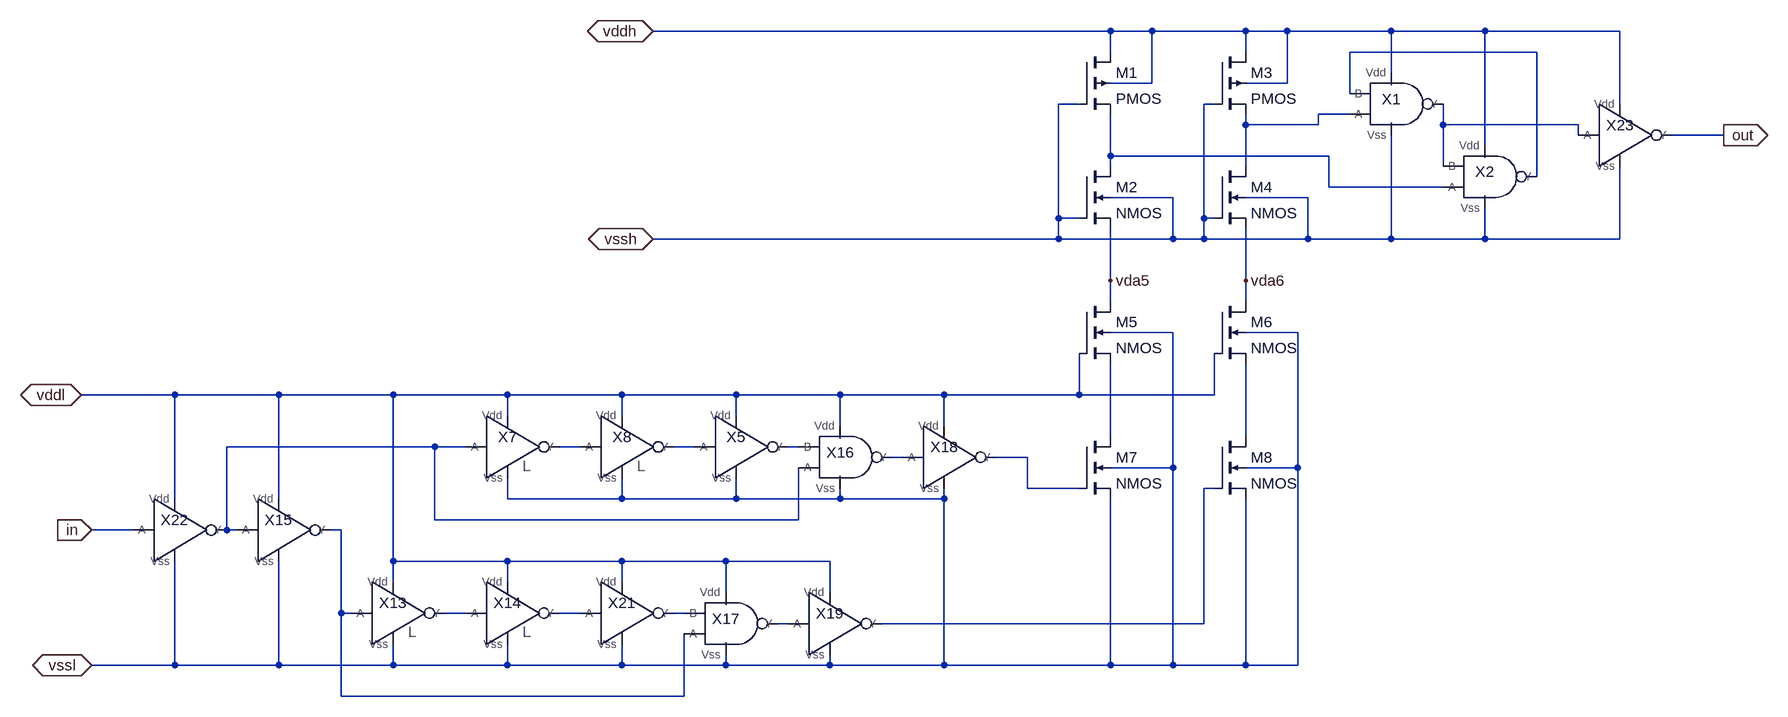
[diagram p0: schematic pulsels.asc]
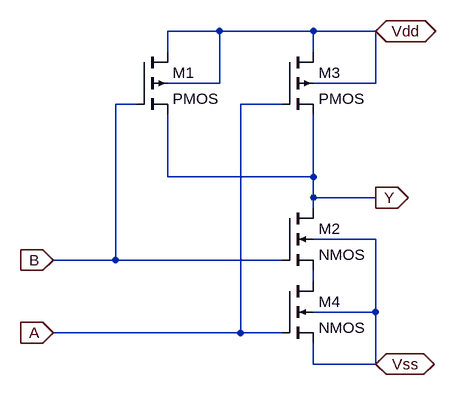
[diagram p1: sub-circuit nand1.asc]
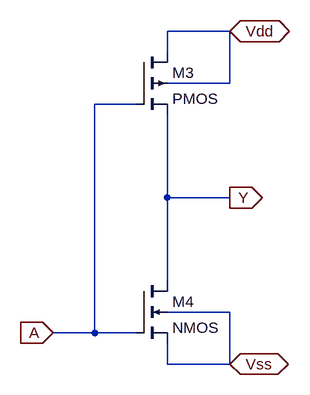
[diagram p2: sub-circuit inv1l.asc]
pulsels.asc, the LTspice schematic file:
Version 4
SHEET 1 1080 1048
WIRE 32 0 -672 0
WIRE 96 0 32 0
WIRE 240 0 96 0
WIRE 304 0 240 0
WIRE 464 0 304 0
WIRE 608 0 464 0
WIRE 816 0 608 0
WIRE 32 32 32 0
WIRE 240 32 240 0
WIRE 688 32 400 32
WIRE 464 64 464 0
WIRE 96 80 96 0
WIRE 96 80 32 80
WIRE 304 80 304 0
WIRE 304 80 240 80
WIRE 400 96 400 32
WIRE -16 112 -48 112
WIRE 192 112 176 112
WIRE 816 112 816 0
WIRE 400 128 352 128
WIRE 240 144 240 128
WIRE 352 144 352 128
WIRE 352 144 240 144
WIRE 544 144 544 112
WIRE 752 144 544 144
WIRE 752 160 752 144
WIRE 976 160 896 160
WIRE 608 176 608 0
WIRE 32 192 32 128
WIRE 368 192 32 192
WIRE 32 208 32 192
WIRE 240 208 240 144
WIRE 544 208 544 144
WIRE 688 224 688 32
WIRE 368 240 368 192
WIRE 544 240 368 240
WIRE 128 256 32 256
WIRE 336 256 240 256
WIRE -48 288 -48 112
WIRE -16 288 -48 288
WIRE 176 288 176 112
WIRE 192 288 176 288
WIRE -48 320 -48 288
WIRE -48 320 -672 320
WIRE 128 320 128 256
WIRE 128 320 -48 320
WIRE 176 320 176 288
WIRE 176 320 128 320
WIRE 336 320 336 256
WIRE 336 320 176 320
WIRE 464 320 464 160
WIRE 464 320 336 320
WIRE 608 320 608 272
WIRE 608 320 464 320
WIRE 816 320 816 208
WIRE 816 320 608 320
WIRE 32 384 32 304
WIRE 240 384 240 304
WIRE 32 416 32 384
WIRE 240 416 240 384
WIRE 128 464 32 464
WIRE 320 464 240 464
WIRE -1408 560 -1552 560
WIRE -1248 560 -1408 560
WIRE -1072 560 -1248 560
WIRE -896 560 -1072 560
WIRE -720 560 -896 560
WIRE -544 560 -720 560
WIRE -384 560 -544 560
WIRE -224 560 -384 560
WIRE -16 560 -16 496
WIRE -16 560 -224 560
WIRE 192 560 192 496
WIRE 192 560 -16 560
WIRE -896 592 -896 560
WIRE -720 592 -720 560
WIRE -544 592 -544 560
WIRE -384 608 -384 560
WIRE -224 608 -224 560
WIRE 32 624 32 512
WIRE 240 624 240 512
WIRE -1008 640 -1328 640
WIRE -960 640 -1008 640
WIRE -784 640 -816 640
WIRE -608 640 -640 640
WIRE -448 640 -464 640
WIRE -288 656 -304 656
WIRE -96 656 -144 656
WIRE 128 672 128 464
WIRE 128 672 32 672
WIRE 320 672 320 464
WIRE 320 672 240 672
WIRE -96 704 -96 656
WIRE -16 704 -96 704
WIRE 192 704 176 704
WIRE -1408 720 -1408 560
WIRE -1248 720 -1248 560
WIRE -896 720 -896 688
WIRE -720 720 -720 688
WIRE -720 720 -896 720
WIRE -544 720 -544 688
WIRE -544 720 -720 720
WIRE -384 720 -384 704
WIRE -384 720 -544 720
WIRE -224 720 -224 704
WIRE -224 720 -384 720
WIRE -1008 752 -1008 640
WIRE -448 752 -448 672
WIRE -448 752 -1008 752
WIRE -1472 768 -1536 768
WIRE -1328 768 -1328 640
WIRE -1312 768 -1328 768
WIRE -1152 768 -1168 768
WIRE -1072 816 -1072 560
WIRE -896 816 -1072 816
WIRE -720 816 -896 816
WIRE -560 816 -720 816
WIRE -400 816 -560 816
WIRE -1072 848 -1072 816
WIRE -896 848 -896 816
WIRE -720 848 -720 816
WIRE -560 864 -560 816
WIRE -400 864 -400 816
WIRE -1152 896 -1152 768
WIRE -1136 896 -1152 896
WIRE -960 896 -992 896
WIRE -784 896 -816 896
WIRE -624 896 -640 896
WIRE -464 912 -480 912
WIRE 176 912 176 704
WIRE 176 912 -320 912
WIRE -1408 976 -1408 816
WIRE -1408 976 -1536 976
WIRE -1248 976 -1248 816
WIRE -1248 976 -1408 976
WIRE -1072 976 -1072 944
WIRE -1072 976 -1248 976
WIRE -896 976 -896 944
WIRE -896 976 -1072 976
WIRE -720 976 -720 944
WIRE -720 976 -896 976
WIRE -560 976 -560 960
WIRE -560 976 -720 976
WIRE -400 976 -400 960
WIRE -400 976 -560 976
WIRE -224 976 -224 720
WIRE -224 976 -400 976
WIRE 32 976 32 720
WIRE 32 976 -224 976
WIRE 128 976 128 672
WIRE 128 976 32 976
WIRE 240 976 240 720
WIRE 240 976 128 976
WIRE 320 976 320 672
WIRE 320 976 240 976
WIRE -1152 1024 -1152 896
WIRE -624 1024 -624 928
WIRE -624 1024 -1152 1024
FLAG -1536 768 in
IOPIN -1536 768 In
FLAG -1552 560 vddl
IOPIN -1552 560 BiDir
FLAG -1536 976 vssl
IOPIN -1536 976 BiDir
FLAG -672 0 vddh
IOPIN -672 0 BiDir
FLAG -672 320 vssh
IOPIN -672 320 BiDir
FLAG 976 160 out
IOPIN 976 160 Out
FLAG 32 384 vda5
FLAG 240 384 vda6
SYMBOL nand1 464 112 R0
SYMATTR InstName X1
SYMBOL nand1 608 224 R0
SYMATTR InstName X2
SYMBOL pmos4 -16 32 R0
SYMATTR InstName M1
SYMATTR Value2 l=0.5u w=0.3u ad=0.25p as=0.25p
SYMBOL nmos4 -16 208 R0
SYMATTR InstName M2
SYMATTR Value2 l=0.2u w=2.5u ad=2p as=0.25p
SYMBOL pmos4 192 32 R0
SYMATTR InstName M3
SYMATTR Value2 l=0.5u w=0.3u ad=0.25p as=0.25p
SYMBOL nmos4 192 208 R0
SYMATTR InstName M4
SYMATTR Value2 l=0.2u w=2.5u ad=2p as=0.25p
SYMBOL nmos4 -16 416 R0
SYMATTR InstName M5
SYMATTR Value2 l=1u w=10u ad=20p as=5p
SYMBOL nmos4 192 416 R0
SYMATTR InstName M6
SYMATTR Value2 l=1u w=10u ad=20p as=5p
SYMBOL nmos4 -16 624 R0
SYMATTR InstName M7
SYMATTR Value2 l=0.2u w=1u ad=5p as=5p
SYMBOL nmos4 192 624 R0
SYMATTR InstName M8
SYMATTR Value2 l=0.2u w=1u ad=5p as=5p
SYMBOL inv1 -544 640 R0
SYMATTR InstName X5
SYMBOL inv1 -1248 768 R0
SYMATTR InstName X15
SYMBOL nand1 -384 656 R0
SYMATTR InstName X16
SYMBOL nand1 -560 912 R0
SYMATTR InstName X17
SYMBOL inv1 -224 656 R0
SYMATTR InstName X18
SYMBOL inv1 -400 912 R0
SYMATTR InstName X19
SYMBOL inv1 -720 896 R0
SYMATTR InstName X21
SYMBOL inv1 -1408 768 R0
SYMATTR InstName X22
SYMBOL inv1 816 160 R0
SYMATTR InstName X23
SYMBOL inv1L -896 640 R0
SYMATTR InstName X7
SYMBOL inv1L -720 640 R0
SYMATTR InstName X8
SYMBOL inv1L -1072 896 R0
SYMATTR InstName X13
SYMBOL inv1L -896 896 R0
SYMATTR InstName X14

nand1.asc, the sub-circuit schematic file:
Version 4
SHEET 1 880 680
WIRE 0 -48 -80 -48
WIRE 144 -48 0 -48
WIRE 240 -48 144 -48
WIRE -80 -16 -80 -48
WIRE 144 -16 144 -48
WIRE 0 32 0 -48
WIRE 0 32 -80 32
WIRE 240 32 240 -48
WIRE 240 32 144 32
WIRE -128 64 -160 64
WIRE 96 64 32 64
WIRE -80 176 -80 80
WIRE 144 176 144 80
WIRE 144 176 -80 176
WIRE 144 208 144 176
WIRE 240 208 144 208
WIRE 144 224 144 208
WIRE 240 272 144 272
WIRE -160 304 -160 64
WIRE -160 304 -256 304
WIRE 96 304 -160 304
WIRE 144 336 144 320
WIRE 240 384 240 272
WIRE 240 384 144 384
WIRE 32 416 32 64
WIRE 32 416 -256 416
WIRE 96 416 32 416
WIRE 144 464 144 432
WIRE 240 464 240 384
WIRE 240 464 144 464
FLAG 240 -48 Vdd
IOPIN 240 -48 BiDir
FLAG 240 464 Vss
IOPIN 240 464 BiDir
FLAG -256 416 A
IOPIN -256 416 In
FLAG 240 208 Y
IOPIN 240 208 Out
FLAG -256 304 B
IOPIN -256 304 In
SYMBOL pmos4 -128 -16 R0
SYMATTR InstName M1
SYMATTR Value2 l=0.2u w=1u ad=0.5p as=0.5p
SYMBOL nmos4 96 224 R0
SYMATTR InstName M2
SYMATTR Value2 l=0.2u w=1u ad=0.5p as=0.5p
SYMBOL pmos4 96 -16 R0
SYMATTR InstName M3
SYMATTR Value2 l=0.2u w=1u ad=0.5p as=0.5p
SYMBOL nmos4 96 336 R0
SYMATTR InstName M4
SYMATTR Value2 l=0.2u w=1u ad=0.5p as=0.5p

inv1l.asc, the sub-circuit schematic file:
Version 4
SHEET 1 880 680
WIRE 240 -48 144 -48
WIRE 144 -16 144 -48
WIRE 240 32 240 -48
WIRE 240 32 144 32
WIRE 96 64 32 64
WIRE 144 208 144 80
WIRE 240 208 144 208
WIRE 144 336 144 208
WIRE 240 384 144 384
WIRE 32 416 32 64
WIRE 32 416 -32 416
WIRE 96 416 32 416
WIRE 144 464 144 432
WIRE 240 464 240 384
WIRE 240 464 144 464
FLAG 240 -48 Vdd
IOPIN 240 -48 BiDir
FLAG 240 464 Vss
IOPIN 240 464 BiDir
FLAG -32 416 A
IOPIN -32 416 In
FLAG 240 208 Y
IOPIN 240 208 Out
SYMBOL pmos4 96 -16 R0
SYMATTR InstName M3
SYMATTR Value2 l=2u w=1u ad=0.5p as=0.5p
SYMBOL nmos4 96 336 R0
SYMATTR InstName M4
SYMATTR Value2 l=2u w=0.5u ad=0.25p as=0.25p

The netlist it stands for:
* pulsels.asc
XX1 N002 N001 vddh vssh N003 nand1
XX2 N004 N003 vddh vssh N001 nand1
M1 vddh vssh N004 vddh PMOS l=0.5u w=0.3u ad=0.25p as=0.25p
M2 N004 vssh vda5 vssh NMOS l=0.2u w=2.5u ad=2p as=0.25p
M3 vddh vssh N002 vddh PMOS l=0.5u w=0.3u ad=0.25p as=0.25p
M4 N002 vssh vda6 vssh NMOS l=0.2u w=2.5u ad=2p as=0.25p
M5 vda5 vddl N005 vssl NMOS l=1u w=10u ad=20p as=5p
M6 vda6 vddl N006 vssl NMOS l=1u w=10u ad=20p as=5p
M7 N005 N012 vssl vssl NMOS l=0.2u w=1u ad=5p as=5p
M8 N006 N013 vssl vssl NMOS l=0.2u w=1u ad=5p as=5p
XX5 N009 vddl vssl N010 inv1  ; pins A Vdd Vss Y
XX15 N007 vddl vssl N014 inv1  ; pins A Vdd Vss Y
XX16 N007 N010 vddl vssl N011 nand1
XX17 N014 N017 vddl vssl N018 nand1
XX18 N011 vddl vssl N012 inv1  ; pins A Vdd Vss Y
XX19 N018 vddl vssl N013 inv1  ; pins A Vdd Vss Y
XX21 N016 vddl vssl N017 inv1  ; pins A Vdd Vss Y
XX22 in vddl vssl N007 inv1  ; pins A Vdd Vss Y
XX23 N003 vddh vssh out inv1  ; pins A Vdd Vss Y
XX7 N007 vddl vssl N008 inv1l
XX8 N008 vddl vssl N009 inv1l
XX13 N014 vddl vssl N015 inv1l
XX14 N015 vddl vssl N016 inv1l

* block symbol definitions
.subckt nand1 A B Vdd Vss Y
M1 Vdd B Y Vdd PMOS l=0.2u w=1u ad=0.5p as=0.5p
M2 Y B N001 Vss NMOS l=0.2u w=1u ad=0.5p as=0.5p
M3 Vdd A Y Vdd PMOS l=0.2u w=1u ad=0.5p as=0.5p
M4 N001 A Vss Vss NMOS l=0.2u w=1u ad=0.5p as=0.5p
.ends nand1

.subckt inv1l A Vdd Vss Y
M3 Vdd A Y Vdd PMOS l=2u w=1u ad=0.5p as=0.5p
M4 Y A Vss Vss NMOS l=2u w=0.5u ad=0.25p as=0.25p
.ends inv1l

.model NMOS NMOS
.model PMOS PMOS
.lib standard.mos
.backanno
.end